# EAGLE design pebble (EAGLE 5.06)
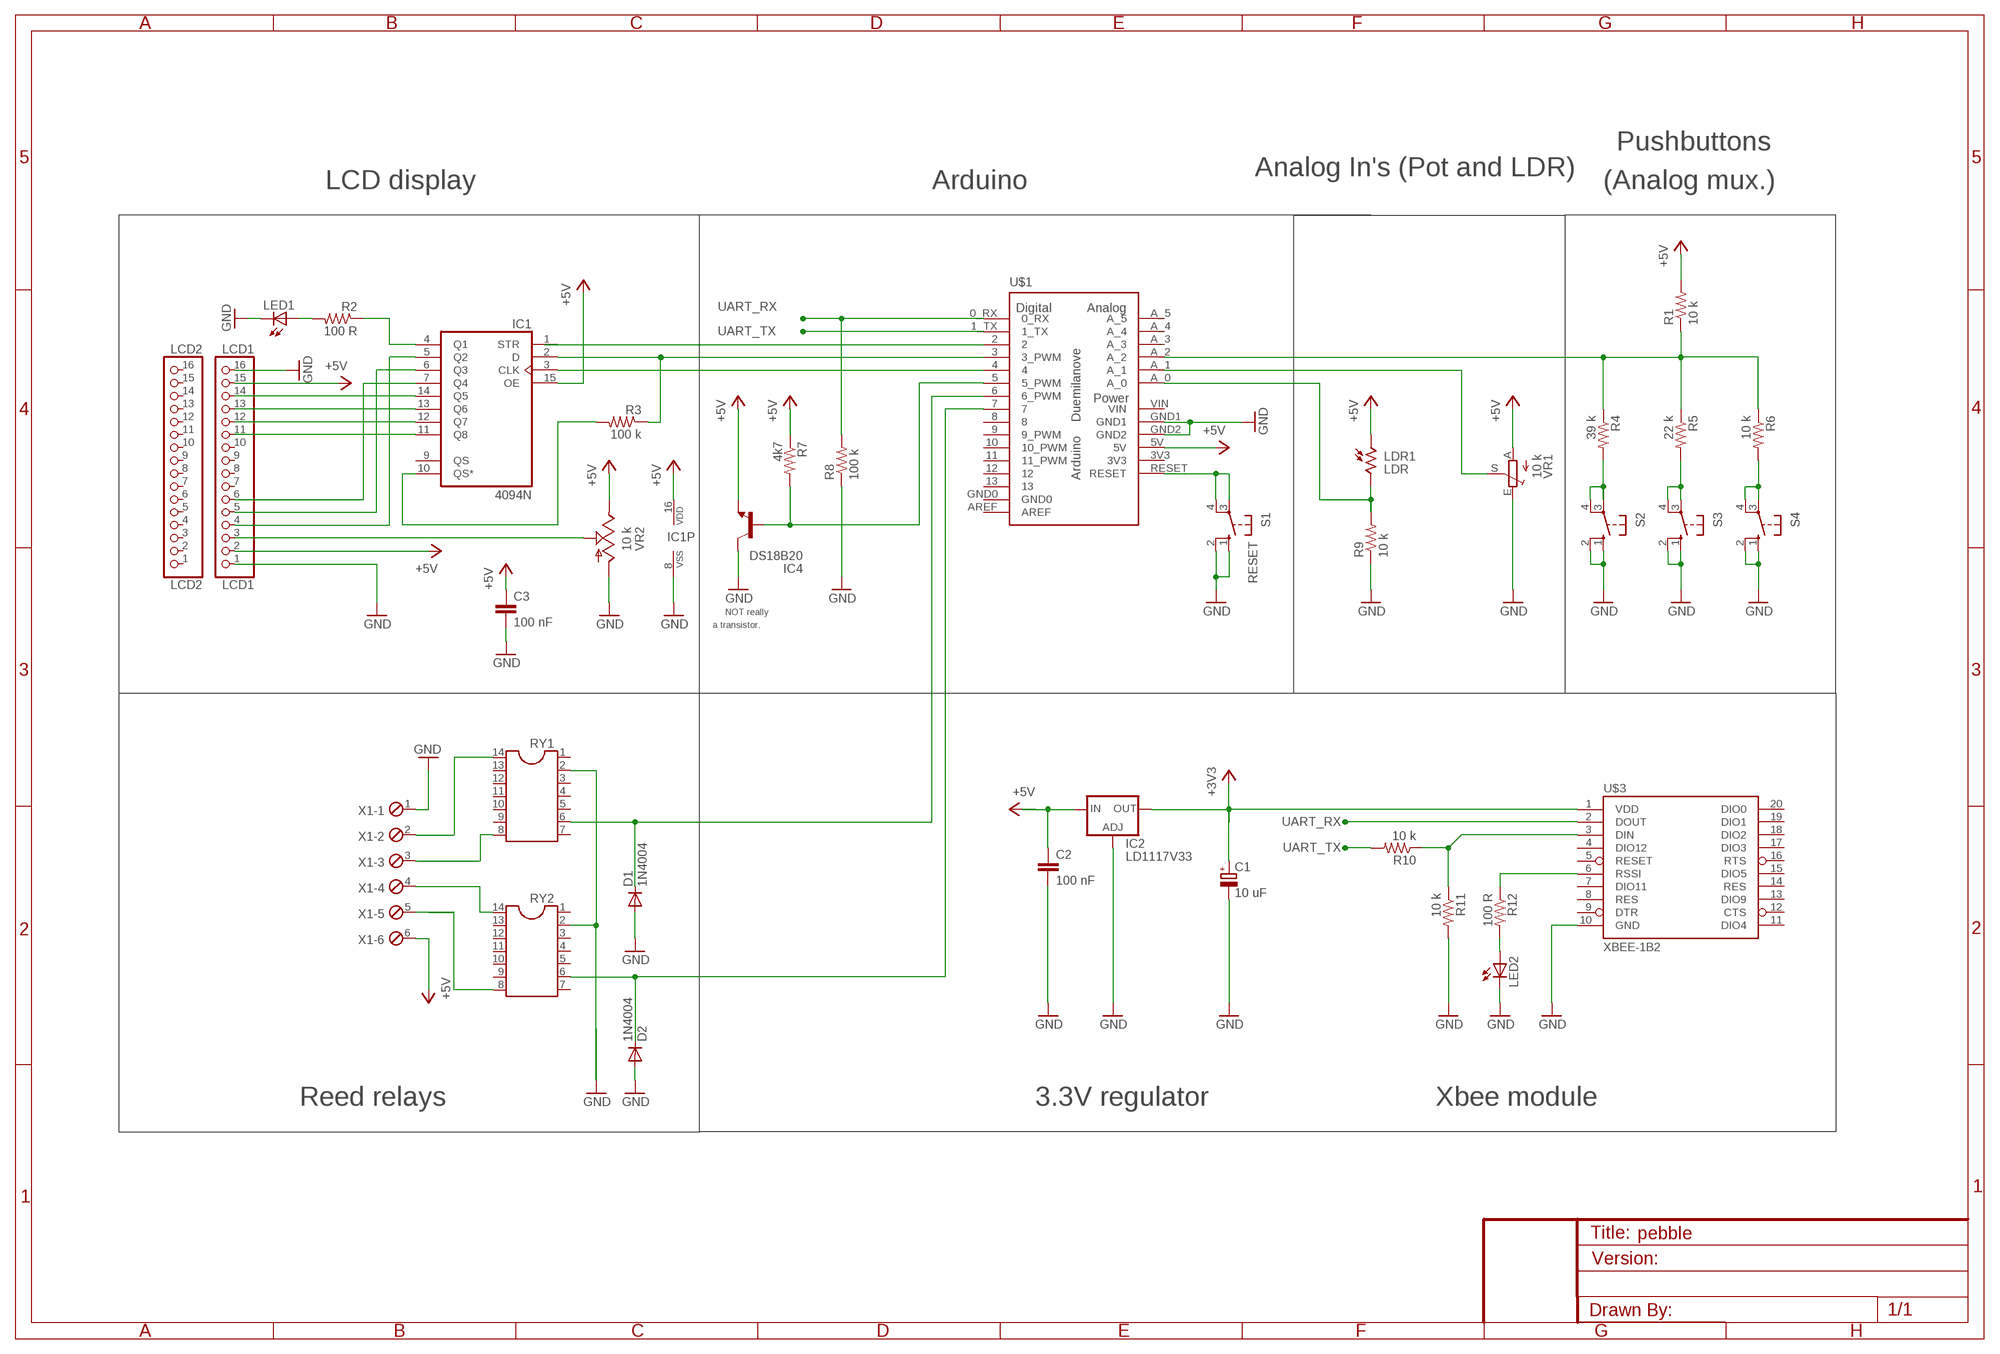
[diagram p0: schematic, sheet 1]

## Parts
C1  10 uF  CPOL-EUE2,5-6E  [E2,5-6E]
C2  100 nF  C2.5/2  [C2.5-2]
C3  100 nF  C2.5/2  [C2.5-2]
D1  1N4004  DIODEPTH  [DIODE-1N4001]
D2  1N4004  DIODEPTH  [DIODE-1N4001]
IC1  4094N  [DIL16]
IC2  LD1117V33  LD117AV33  [TO220L1]
IC4  DS18B20  BC548  [TO92-EBC]
LCD1  LCD1  PINHD-1X16  [1X16]
LCD2  LCD2  PINHD-1X16  [1X16]
LDR1  LDR  VT80N1  [VT800]
LED1  LED3MM  [LED3MM]
LED2  LED3MM  [LED3MM]
R1  10 k  RESISTORPTH1  [AXIAL-0.3]
R2  100 R  RESISTORPTH1  [AXIAL-0.3]
R3  100 k  RESISTORPTH1  [AXIAL-0.3]
R4  39 k  RESISTORPTH1  [AXIAL-0.3]
R5  22 k  RESISTORPTH1  [AXIAL-0.3]
R6  10 k  RESISTORPTH1  [AXIAL-0.3]
R7  4k7  RESISTORPTH1  [AXIAL-0.3]
R8  100 k  RESISTORPTH1  [AXIAL-0.3]
R9  10 k  RESISTORPTH1  [AXIAL-0.3]
R10  10 k  RESISTORPTH1  [AXIAL-0.3]
R11  10 k  RESISTORPTH1  [AXIAL-0.3]
R12  100 R  RESISTORPTH1  [AXIAL-0.3]
RY1  DIL14S  [SOCKET-14]
RY2  DIL14S  [SOCKET-14]
S1  RESET  10-XX  [B3F-10XX]
S2  10-XX  [B3F-10XX]
S3  10-XX  [B3F-10XX]
S4  10-XX  [B3F-10XX]
U$1  ARDUINO-USBLONG_PADS_TEXT  [SHIELD]
U$3  XBEE-1B2  [XBEE-SILK]
VR1  10 k  TRIM_EU-B25V  [B25V]
VR2  10 k  TRIM_US-RS3  [RS3]
X1  MPT6  [6POL254]

## Nets
+3V3: C1.+ IC2.2(OUT) U$3.1(VDD)
+5V: C2.1 C3.1 IC1.15(OE) IC1.16(VDD) IC2.3(IN) IC4.E LCD1.2 LCD1.15 LDR1.1 R1.P$2 R7.P$1 U$1.5V VR1.A VR2.E X1.6
GND: C1.- C2.2 C3.2 D1.A D2.A IC1.8(VSS) IC2.1(ADJ) IC4.C LCD1.1 LCD1.16 LED1.K(C) LED2.K(C) R8.P$1 R9.P$1 R11.P$2 RY1.2 RY2.2 S1.1(S) S1.2(S1) S2.1(S) S2.2(S1) S3.1(S) S3.2(S1) S4.1(S) S4.2(S1) U$1.GND1 U$1.GND2 U$3.10(GND) VR1.E VR2.A X1.1
N$1: IC1.1(STR) U$1.2
N$2: IC1.3(CLK) U$1.4
N$3: IC1.2(D) R3.P$1 U$1.3(3_PWM)
N$5: D2.C RY2.6 U$1.7
N$6: R1.P$1 R4.P$1 R5.P$1 R6.P$1 U$1.A_2
N$7: IC1.4(Q1) R2.P$1
N$9: LED1.A R2.P$2
N$10: IC1.10(QS*) R3.P$2
N$11: U$1.A_1 VR1.S
N$13: LDR1.2 R9.P$2 U$1.A_0
N$14: IC1.11(Q8) LCD1.11
N$15: IC1.12(Q7) LCD1.12
N$16: IC1.13(Q6) LCD1.13
N$17: IC1.14(Q5) LCD1.14
N$18: IC1.5(Q2) LCD1.4
N$19: IC1.6(Q3) LCD1.5
N$20: IC1.7(Q4) LCD1.6
N$21: RY1.14 X1.2
N$22: IC4.B R7.P$2 U$1.5(5_PWM)
N$23: R12.P$1 U$3.6(RSSI)
N$24: LED2.A R12.P$2
N$26: R10.P$1 R11.P$1 U$3.3(DIN)
N$34: RY1.8 X1.3
N$64: RY2.14 X1.4
N$65: RY2.8 X1.5
N$66: D1.C RY1.6 U$1.6(6_PWM)
N$70: R4.P$2 S2.3(P) S2.4(P1)
N$72: R5.P$2 S3.3(P) S3.4(P1)
N$73: R6.P$2 S4.3(P) S4.4(P1)
N$93: LCD1.3 VR2.S
N$147: S1.3(P) S1.4(P1) U$1.RESET
UART_RX: R8.P$2 U$1.0_RX U$3.2(DOUT)
UART_TX: R10.P$2 U$1.1_TX
Unconnected: IC1.9(QS) LCD1.7 LCD1.8 LCD1.9 LCD1.10 LCD2.1 LCD2.2 LCD2.3 LCD2.4 LCD2.5 LCD2.6 LCD2.7 LCD2.8 LCD2.9 LCD2.10 LCD2.11 LCD2.12 LCD2.13 LCD2.14 LCD2.15 LCD2.16 RY1.1 RY1.3 RY1.4 RY1.5 RY1.7 RY1.9 RY1.10 RY1.11 RY1.12 RY1.13 RY2.1 RY2.3 RY2.4 RY2.5 RY2.7 RY2.9 RY2.10 RY2.11 RY2.12 RY2.13 U$1.8 U$1.9(9_PWM) U$1.10(10_PWM) U$1.11(11_PWM) U$1.12 U$1.13 U$1.A_3 U$1.A_4 U$1.A_5 U$1.AREF U$1.GND0 U$3.4(DIO12) U$3.5(RESET) U$3.7(DIO11) U$3.8(RES) U$3.9(DTR) U$3.11(DIO4) U$3.12(CTS) U$3.13(DIO9) U$3.14(RES) U$3.15(DIO5) U$3.16(RTS) U$3.17(DIO3) U$3.18(DIO2) U$3.19(DIO1) U$3.20(DIO0)

## Notes on the sheet
- Pushbuttons
- Analog In's (Pot and LDR)
- LCD display | Arduino | (Analog mux.)
- NOT really
- a transistor.
- Reed relays | 3.3V regulator | Xbee module

## Power pins joined to a net without a drawn wire
3V3: U$1.3V3
VIN: U$1.VIN

## Library data of the parts
C1 = rcl:CPOL-EU: POLARIZED CAPACITOR, European symbol
C2 C3 = capacitor-wima:C: CAPACITOR naming: grid - package width
D1 D2 = SparkFun:DIODE: Diode These are standard reverse protection diodes and small signal diodes. SMA package can handle up to about 1A. SOD-323 can handle about 200mA. What the SOD-323 package when ordering, there are some mfgs out there that are 5-pin packages.
IC1 = 40xx:4094: 8-stage SHIFT/STORE REGISTER, tri-state
IC2 = v-reg:LD117A?*: Low drop fixed and adjustable positive voltage regulators 1 A Source: http://www.st.com/stonline/products/literature/ds/7194/ld1117axx.pdf
IC4 = transistor-npn:BC548*: NPN Transistor
LCD1 LCD2 = pinhead:PINHD-1X16: PIN HEADER
LDR1 = photo-elements:VT8: Photoconductive Cell VT800 Series Source: http://optoelectronics.perkinelmer.com/content/Datasheets/DTS_vt800seriesdatasheet.pdf
LED1 LED2 = led:LED: LED OSRAM: - CHIPLED LG R971, LG N971, LY N971, LG Q971, LY Q971, LO R971, LY R971 LH N974, LH R974 LS Q976, LO Q976, LY Q976 LO Q996 - Hyper CHIPLED LW Q18S LB Q993, LB Q99A, LB R99A - SideLED LS A670, LO A670, LY A670, LG A670, LP A670 LB A673, LV A673, LT A673, LW A673 LH A674 LY A675 LS A676, LA A676, LO A676, LY A676, LW A676 LS A679, LY A679, LG A679 - Hyper Micro SIDELED® LS Y876, LA Y876, LO Y876, LY Y876 LT Y87S - SmartLED LW L88C, LW L88S LB L89C, LB L89S, LG L890 LS L89K, LO L89K, LY L89K LS L896, LA L896, LO L896, LY L896 - TOPLED LS T670, LO T670, LY T670, LG T670, LP T670 LSG T670, LSP T670, LSY T670, LOP T670, LYG T670 LG T671, LOG T671, LSG T671 LB T673, LV T673, LT T673, LW T673 LH T674 LS T676, LA T676, LO T676, LY T676, LB T676, LH T676, LSB T676, LW T676 LB T67C, LV T67C, LT T67C, LS T67K, LO T67K, LY T67K, LW E67C LS E67B, LA E67B, LO E67B, LY E67B, LB E67C, LV E67C, LT E67C LW T67C LS T679, LY T679, LG T679 LS T770, LO T770, LY T770, LG T770, LP T770 LB T773, LV T773, LT T773, LW T773 LH T774 LS E675, LA E675, LY E675, LS T675 LS T776, LA T776, LO T776, LY T776, LB T776 LHGB T686 LT T68C, LB T68C - Hyper Mini TOPLED® LB M676 - Mini TOPLED Santana® LG M470 LS M47K, LO M47K, LY M47K Source: http://www.osram.convergy.de LUXEON: - LUMILED® LXK2-PW12-R00, LXK2-PW12-S00, LXK2-PW14-U00, LXK2-PW14-V00 LXK2-PM12-R00, LXK2-PM12-S00, LXK2-PM14-U00 LXK2-PE12-Q00, LXK2-PE12-R00, LXK2-PE12-S00, LXK2-PE14-T00, LXK2-PE14-U00 LXK2-PB12-K00, LXK2-PB12-L00, LXK2-PB12-M00, LXK2-PB14-N00, LXK2-PB14-P00, LXK2-PB14-Q00 LXK2-PR12-L00, LXK2-PR12-M00, LXK2-PR14-Q00, LXK2-PR14-R00 LXK2-PD12-Q00, LXK2-PD12-R00, LXK2-PD12-S00 LXK2-PH12-R00, LXK2-PH12-S00 LXK2-PL12-P00, LXK2-PL12-Q00, LXK2-PL12-R00 Source: www.luxeon.com KINGBRIGHT: KA-3528ASYC Source: www.kingbright.com
R1-R12 = SparkFun:RESISTOR: Resistor Basic schematic elements and footprints for 0603, 1206, and PTH 1/10th watt (small) resistors.
RY1 RY2 = ic-package:DIL14: Dual In Line / Socket
S1-S4 = switch-omron:10-XX: OMRON SWITCH
U$1 = Arduino-Various:ARDUINO-USB: The Ardiuno Duemilanove Pinouts layoutet as a Bare Shield. v0.5 Also for Arduino Diecimila. This is designed as a Part and has no Outline in the Dimension Layer. The Outline, when present, is drawed at the tPlace / bPlace Layer. Library by Stephanie Lange, http://www.k-ita.de/~sl/
U$3 = xbee:XBEE-1
VR1 = pot:TRIM_EU-: POTENTIOMETER
VR2 = pot:TRIM_US-: POTENTIOMETER
X1 = con-phoenix-254:MPT6: PHOENIX CONNECTOR

## Board
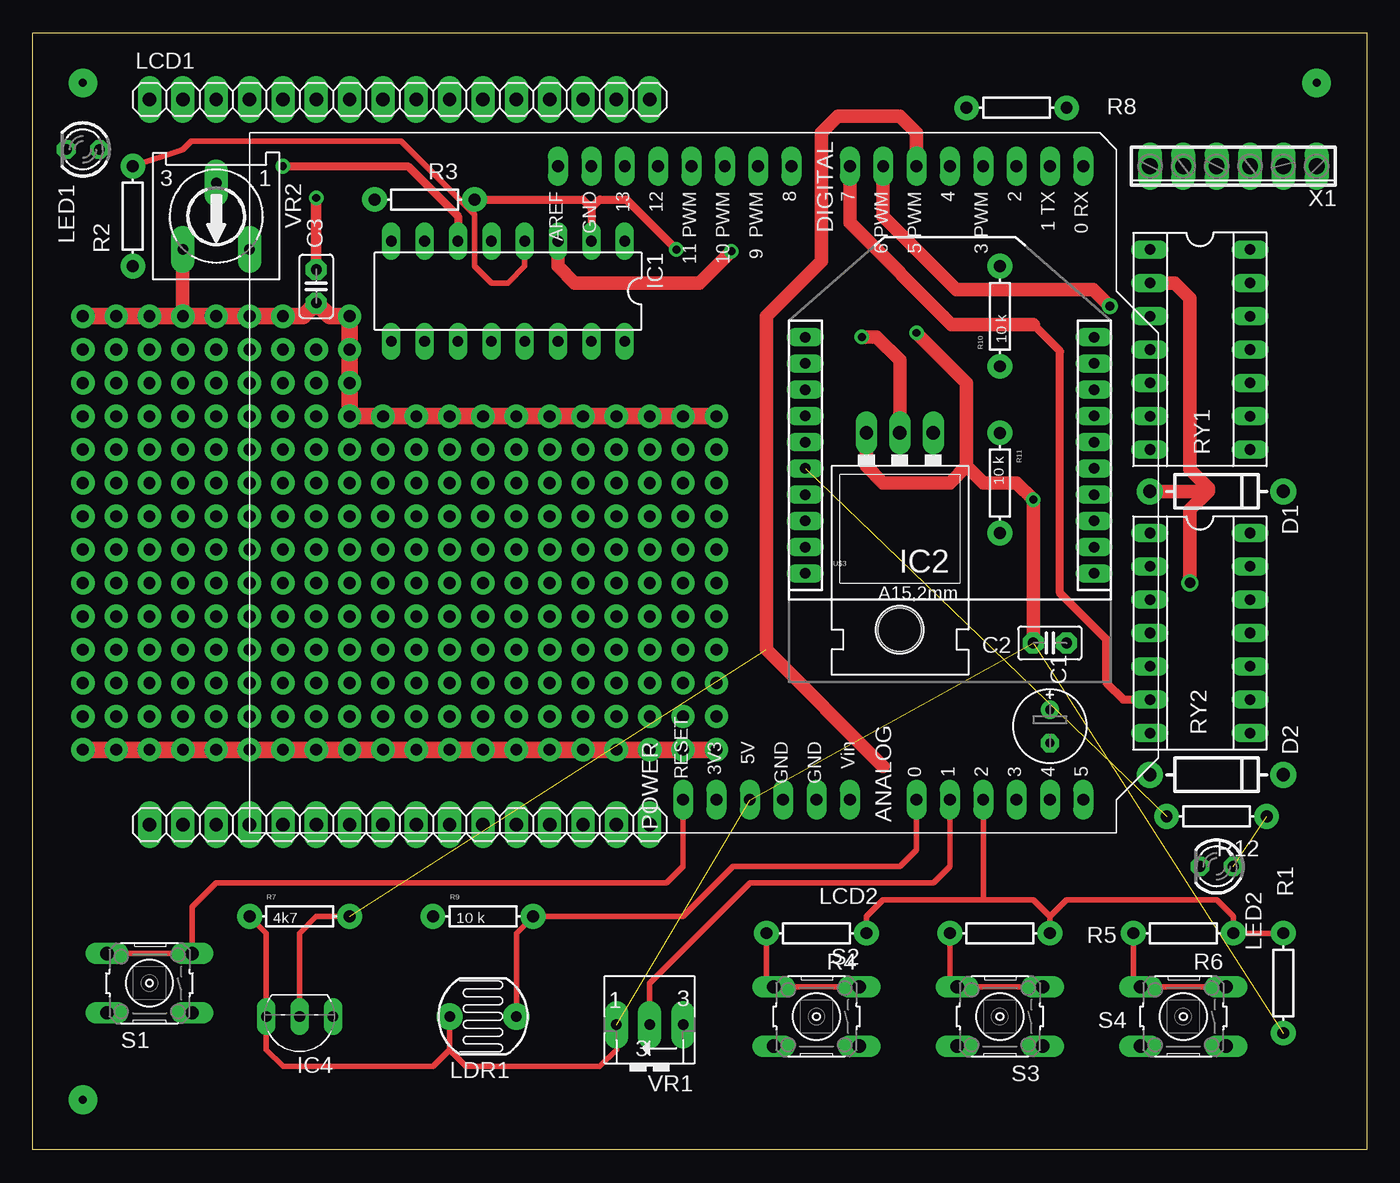
[diagram p1: board, top side]
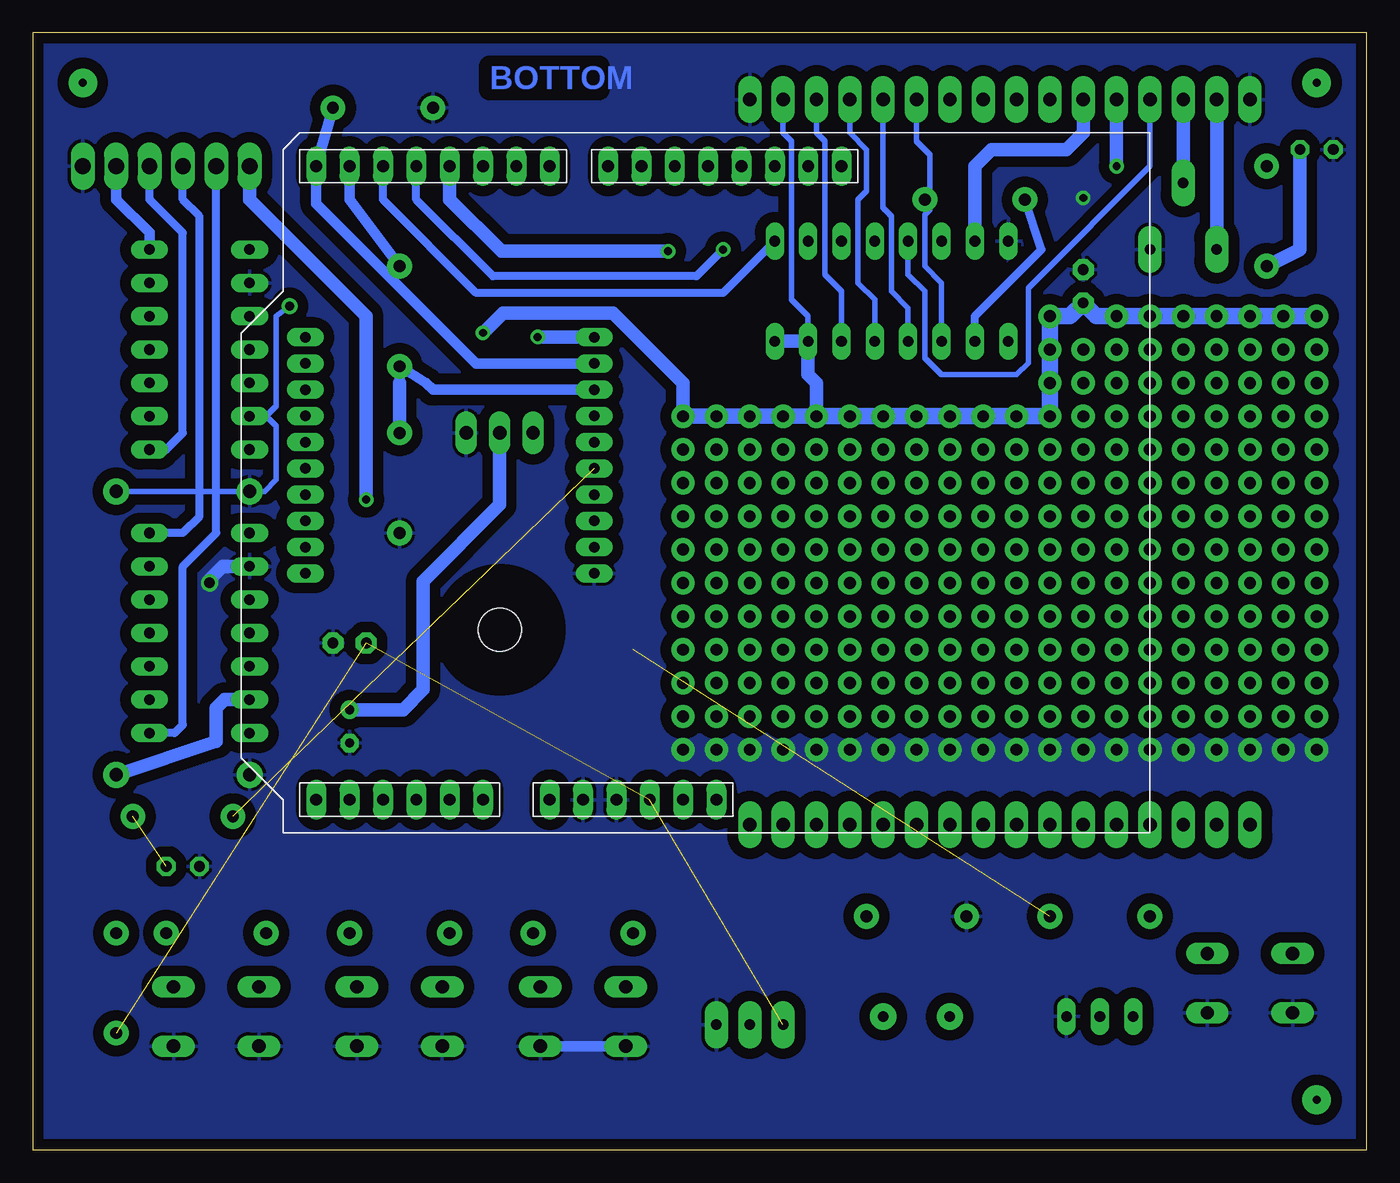
[diagram p2: board, bottom side, seen from below]

Size 101.6 x 85.09 mm. Coordinates in mm from the lower left corner, seen from the top.
Outline: 0,85.09 101.6,85.09 101.6,0 0,0 0,85.09
Copper layers (1*16): Top 0.035mm / dielectric 1.5mm / Bottom 0.035mm
Design rules "SparkFun": minimum track width 8mil, minimum drill 20mil, track to track 8mil, track to pad 8mil, pad to pad 8mil, via to via 8mil, smd to smd 8mil, copper to edge 10mil, drill to drill 8mil, minimum pad ring 12mil, minimum via ring 10mil, stop-mask expansion 4mil, vias tented up to drill 25mil, thermal gap 10mil

### Footprints (pad centres in the part's own frame; a part is rotated, then mirrored left to right if it is on the bottom)
E2,5-6E = drill 0.7 pad 1.4 round: + -1.27,0 | drill 0.7 pad 1.4 octagon: - 1.27,0
C2.5-2 = drill 0.813 pad 1.6 octagon: 1 -1.27,0; 2 1.27,0
DIODE-1N4001 = drill 1 pad 1.981 round: A -5.08,0; C 5.08,0
DIL16 = drill 0.813 long: 1 -8.89,-3.81; 2 -6.35,-3.81; 3 -3.81,-3.81; 4 -1.27,-3.81; 5 1.27,-3.81; 6 3.81,-3.81; 7 6.35,-3.81; 8 8.89,-3.81; 9 8.89,3.81; 10 6.35,3.81; 11 3.81,3.81; 12 1.27,3.81; 13 -1.27,3.81; 14 -3.81,3.81; 15 -6.35,3.81; 16 -8.89,3.81
TO220L1 = drill 1.016 long: 1 -2.54,-3.81; 2 0,-3.81; 3 2.54,-3.81 | hole 3.302: 0,11.176
TO92-EBC = drill 0.813 long: B 0,-1.27; C -2.54,-1.27; E 2.54,-1.27
1X16 = drill 1.016 pad 1.8 long: 1 -19.05,0; 2 -16.51,0; 3 -13.97,0; 4 -11.43,0; 5 -8.89,0; 6 -6.35,0; 7 -3.81,0; 8 -1.27,0; 9 1.27,0; 10 3.81,0; 11 6.35,0; 12 8.89,0; 13 11.43,0; 14 13.97,0; 15 16.51,0; 16 19.05,0
VT800 = drill 0.8 pad 2 round: 1 -2.54,0; 2 2.54,0
LED3MM = drill 0.813 octagon: A -1.27,0; K 1.27,0
AXIAL-0.3 = drill 0.9 pad 1.88 round: P$1 -3.81,0; P$2 3.81,0
SOCKET-14 = drill 0.813 long: 1 -7.62,-3.81; 2 -5.08,-3.81; 3 -2.54,-3.81; 4 0,-3.81; 5 2.54,-3.81; 6 5.08,-3.81; 7 7.62,-3.81; 8 7.62,3.81; 9 5.08,3.81; 10 2.54,3.81; 11 0,3.81; 12 -2.54,3.81; 13 -5.08,3.81; 14 -7.62,3.81
B3F-10XX = drill 1.016 long: 1 -3.251,2.261; 2 3.251,2.261; 3 -3.251,-2.261; 4 3.251,-2.261
SHIELD = drill 0.9 pad 1.27 long: 0_RX -25.4,27.94; 1_TX -25.4,25.4; 2 -25.4,22.86; 3 -25.4,20.32; 3V3 22.86,0; 4 -25.4,17.78; 5 -25.4,15.24; 5V 22.86,2.54; 6 -25.4,12.7; 7 -25.4,10.16; 8 -25.4,5.715; 9 -25.4,3.175; 10 -25.4,0.635; 11 -25.4,-1.905; 12 -25.4,-4.445; 13 -25.4,-6.985; A_0 22.86,15.24; A_1 22.86,17.78; A_2 22.86,20.32; A_3 22.86,22.86; A_4 22.86,25.4; A_5 22.86,27.94; AREF -25.4,-12.065; GND0 -25.4,-9.525; GND1 22.86,7.62; GND2 22.86,5.08; RESET 22.86,-2.54; VIN 22.86,10.16
XBEE-SILK = drill 0.8 long: 1 -11,20; 2 -11,18; 3 -11,16; 4 -11,14; 5 -11,12; 6 -11,10; 7 -11,8; 8 -11,6; 9 -11,4; 10 -11,2; 11 11,2; 12 11,4; 13 11,6; 14 11,8; 15 11,10; 16 11,12; 17 11,14; 18 11,16; 19 11,18; 20 11,20
B25V = drill 0.8 pad 1.8 long: A 2.54,0.635; E -2.54,0.635; S 0,0.635
RS3 = drill 0.8 pad 1.8 long: A -2.54,2.54; E 2.54,2.54; S 0,-2.54
6POL254 = drill 1.2 pad 1.778 long: 1 -6.35,0; 2 -3.81,0; 3 -1.27,0; 4 1.27,0; 5 3.81,0; 6 6.35,0

### Placement (x,y rotation side)
C1  77.47,32.26 270 top
C2  77.47,38.61 0 top
C3  21.59,65.79 90 top
D1  90.17,50.16 0 top
D2  90.17,28.58 0 top
IC1  36.2,65.41 180 top
IC2  66.04,50.8 180 top
IC4  20.32,8.89 180 top
LCD1  27.94,80.01 0 top
LCD2  27.94,24.77 0 top
LDR1  34.29,10.16 0 top
LED1  3.81,76.2 180 top
LED2  90.17,21.59 180 top
R1  95.25,12.7 270 top
R2  7.62,71.12 270 top
R3  29.84,72.39 180 top
R4  59.69,16.51 180 top
R5  73.66,16.51 180 top
R6  87.63,16.51 180 top
R7  20.32,17.78 0 top
R8  74.93,79.38 0 top
R9  34.29,17.78 0 top
R10  73.66,63.5 90 top
R11  73.66,50.8 270 top
R12  90.17,25.4 0 top
RY1  88.9,60.96 270 top
RY2  88.9,39.37 270 top
S1  8.89,12.7 180 top
S2  59.69,10.16 180 top
S3  73.66,10.16 180 top
S4  87.63,10.16 180 top
U$1  52.07,49.53 270 top
U$3  69.85,41.91 0 top
VR1  46.99,10.16 180 top
VR2  13.97,71.12 180 top
X1  91.44,74.93 180 top

### Tracks (layer width: path | path; a pad name or v marks a point on that pad's centre or on a via)
+3V3  (via drill 0.6)
  Top 1.016: v63.14,61.93 64.26,61.93 66.04,60.15 IC2.2
  Bottom 1.016: IC2.2 66.04,49.15 71.88,43.31 71.88,35.05 73.41,33.53 C1.+ | U$3.1 63.13,61.91 v63.14,61.93
+5V  (via drill 0.6, 0.9 pad 1.78)  (3 unrouted)
  Top 0.406: R7.P$1 17.78,16.51 IC4.E 17.78,7.62 19.05,6.35 30.48,6.35 31.75,7.62 | VR1.A 44.45,7.62 43.18,6.35 33.02,6.35 31.75,7.62 | 31.75,7.62 LDR1.1
  Top 1.016: v11.43,63.5 VR2.E | IC2.3 63.5,52.07 64.77,50.8 69.85,50.8 71.12,52.07 | v67.31,62.23 71.12,58.42 71.12,52.07 | 71.12,52.07 72.39,50.8 74.93,50.8 v76.2,49.53 C2.1
  Top 1.17: v24.13,63.5 v24.13,60.96 v24.13,58.42 v24.13,55.88
  Top 1.27: v3.81,63.5 v6.35,63.5 v8.89,63.5 v11.43,63.5 v13.97,63.5 v16.51,63.5 v19.05,63.5 20.57,63.5 C3.1 22.61,63.5 v24.13,63.5 v24.13,55.88 | v52.07,55.88 v49.53,55.88 | v46.99,55.88 v49.53,55.88 | v41.91,55.88 v46.99,55.88 | v41.91,55.88 v39.37,55.88 | v24.13,55.88 v26.67,55.88 | v31.75,55.88 v34.29,55.88 | v29.21,55.88 v31.75,55.88 | v26.67,55.88 v29.21,55.88 | v39.37,55.88 v36.83,55.88 | v36.83,55.88 v34.29,55.88 | v46.99,55.88 v49.53,55.88 | v52.07,55.88 v49.53,55.88 | v41.91,55.88 v52.07,55.88 | v41.91,55.88 v39.37,55.88 | v39.37,55.88 v36.83,55.88 | v36.83,55.88 v34.29,55.88 | v24.13,55.88 v26.67,55.88 | v29.21,55.88 v31.75,55.88 | v36.83,55.88 v34.29,55.88 | v31.75,55.88 v34.29,55.88
  Bottom 0.406: LCD1.15 44.45,77.47 44.45,77.46
  Bottom 0.408: 44.45,77.46 43.81,76.83 43.81,64.77 42.54,63.5 IC1.15
  Bottom 0.61: VR2.E | IC1.15 IC1.16
  Bottom 1.016: v67.31,62.23 65.79,63.75 57.4,63.75 52.07,58.42 v52.07,55.88 | VR2.E LCD1.2 | v76.2,49.53 76.2,63.5 85.09,72.39 X1.6 | IC1.16 IC1.15 42.54,59.05 41.91,58.42 v41.91,55.88
  Bottom 1.17: v52.07,55.88 v44.45,55.88 v41.91,55.88
  Bottom 1.27: v41.91,55.88 v24.13,55.88 v24.13,63.5 22.61,63.5 C3.1 20.57,63.5 v19.05,63.5 v16.51,63.5 v13.97,63.5 v11.43,63.5 v8.89,63.5 v6.35,63.5 v3.81,63.5
GND  (via drill 0.6, 0.8, 0.9 pad 1.78)
  Top 0.813: C3.2 v21.59,72.52
  Top 1.016: RY1.2 87,66.04 88.14,64.9 88.14,51.82 89.54,50.42 89.54,50.16 | 89.54,50.16 D1.A | 89.54,50.16 88.14,48.77 v88.14,43.18
  Top 1.27: v3.81,30.48 v52.07,30.48
  Bottom 0.5: RY1.2 84.45,66.04
  Bottom 0.813: S2.2 S2.1
  Bottom 1.016: RY2.2 87.12,44.45 88.14,43.43
  other vias: 6.35,30.48 8.89,30.48 11.43,30.48 13.97,30.48 16.51,30.48 19.05,30.48 21.59,30.48 24.13,30.48 26.67,30.48 29.21,30.48 31.75,30.48 34.29,30.48 36.83,30.48 39.37,30.48 41.91,30.48 44.45,30.48 46.99,30.48 49.53,30.48
  pour Bottom (isolate 0.813): 0,85.09 101.6,85.09 101.6,0 0,0
N$1
  Bottom 0.61: U$1.2 74.93,72.39 67.82,65.28 49.02,65.28 IC1.1
N$2  (via drill 0.6)
  Top 1.016: IC1.3 40,67.31 41.27,66.04 50.8,66.04 v53.21,68.45
  Bottom 1.016: U$1.4 69.85,72.39 65.91,68.45 v53.21,68.45
N$3  (via drill 0.6)
  Top 0.61: R3.P$1 41.91,72.39 42.54,71.75 | 42.54,71.75 IC1.2 | 42.54,71.75 43.18,72.39 45.21,72.39 v49.02,68.58
  Bottom 0.61: U$1.3 72.39,72.39 66.55,66.55 51.05,66.55 v49.02,68.58
N$5
  Top 0.61: 76.2,62.87 78.23,60.83 78.23,42.42 81.79,38.86 81.79,35.56 83.06,34.29 RY2.6
  Top 1.016: U$1.7 62.23,70.61 69.98,62.87 76.2,62.87
  Bottom 1.016: RY2.6 87,34.29 87.63,33.66 87.63,31.12 D2.C
N$6
  Top 0.406: R4.P$1 63.5,17.78 64.77,19.05 72.39,19.05 | 72.39,19.05 76.2,19.05 77.47,17.78 | 77.47,17.78 R5.P$1 | 77.47,17.78 78.74,19.05 90.17,19.05 91.44,17.78 R6.P$1 R1.P$1 | 72.39,19.05 U$1.A_2
N$7
  Top 0.406: IC1.4 37.46,67.31 36.2,66.04 34.92,66.04 33.65,67.31 33.65,71.25 28.07,76.83 12.07,76.83 11.43,76.2 R2.P$1
N$9
  Bottom 1.016: LED1.A 5.08,68.58 R2.P$2
N$10
  Bottom 0.61: R3.P$2 24.77,68.58 29.84,63.5 IC1.10
N$11
  Top 0.406: U$1.A_1 69.85,21.59 68.58,20.32 54.61,20.32 46.99,12.7 VR1.S
N$12  (via drill 0.6 pad 2.18)
  other vias: 143.51,7.62
N$13
  Top 0.406: LDR1.2 36.83,16.51 R9.P$2 49.53,17.78 53.34,21.59 66.04,21.59 67.31,22.86 U$1.A_0
N$14
  Bottom 0.406: LCD1.11 34.29,76.83 33.27,75.82 33.27,71.63 33.65,71.25 33.65,67.31 33.65,67.3
  Bottom 0.408: 33.65,67.3 32.38,66.04 IC1.11
N$15
  Bottom 0.406: 36.2,66.67 36.19,65.4 36.19,71.11 36.83,71.75 LCD1.12
  Bottom 0.408: 36.19,65.4 34.92,64.13 IC1.12
N$16
  Bottom 0.406: LCD1.13 39.37,77.47 39.36,77.46 | 38.1,73.66 38.1,73.02 38.73,72.39 38.73,70.48
  Bottom 0.408: 39.36,77.46 38.1,76.2 38.1,73.66 | 38.73,70.48 38.73,66.04 37.46,64.77 IC1.13
N$17
  Bottom 0.406: LCD1.14 41.91,77.47 41.9,77.46
  Bottom 0.408: 41.9,77.46 41.27,76.83 41.27,66.67 40,65.41 IC1.14
N$18
  Bottom 0.406: 29.84,59.05 26.67,59.05 25.78,59.94 25.78,65.66 25.4,66.04
  Bottom 0.408: IC1.5 34.92,66.67 33.65,65.41 33.65,60.33 32.38,59.05 29.84,59.05 | LCD1.4 16.51,74.93 25.4,66.04
  Bottom 0.61: LCD1.4
N$19  (via drill 0.6)
  Top 0.61: IC1.6 32.38,71.12 28.57,74.93 v19.05,74.93
  Bottom 0.61: LCD1.5
  Bottom 1.016: v19.05,74.93 LCD1.5
N$20
  Bottom 1.016: LCD1.6 21.59,77.47 22.86,76.2 28.57,76.2 29.84,74.93 IC1.7
N$21
  Bottom 0.813: RY1.14 92.71,69.85 95.25,72.39 X1.2
N$22  (1 unrouted)
  Top 0.406: IC4.B 20.32,16.51 21.59,17.78 R7.P$2
  Top 1.016: U$1.5 67.31,77.47 66.04,78.74 61.34,78.74 60.07,77.47 60.07,67.69 55.88,63.5 55.88,38.1 64.77,29.21
N$23  (1 unrouted)
N$24  (1 unrouted)
N$26
  Bottom 0.61: R11.P$1 73.66,55.88
  Bottom 0.813: 73.66,58.42 R10.P$1 71.63,58.42 71.12,57.91 U$3.3
  Bottom 1.016: 73.66,58.42 R11.P$1
N$30  (via drill 0.6 pad 2.18)
  other vias: 3.81,3.81
N$34
  Bottom 0.61: RY1.8 91.44,53.34 90.17,54.61 90.17,69.85 92.71,72.39 X1.3
N$39  (via drill 0.9 pad 1.78)
  other vias: 52.07,53.34
N$40  (via drill 0.9 pad 1.78)
  other vias: 52.07,50.8
N$41  (via drill 0.9 pad 1.78)
  other vias: 24.13,53.34
N$42  (via drill 0.9 pad 1.78)
  other vias: 24.13,50.8
N$43  (via drill 0.9 pad 1.78)
  other vias: 49.53,53.34
N$44  (via drill 0.9 pad 1.78)
  other vias: 46.99,53.34
N$45  (via drill 0.9 pad 1.78)
  other vias: 44.45,53.34
N$46  (via drill 0.9 pad 1.78)
  other vias: 41.91,53.34
N$47  (via drill 0.9 pad 1.78)
  other vias: 39.37,53.34
N$48  (via drill 0.9 pad 1.78)
  other vias: 26.67,53.34
N$49  (via drill 0.9 pad 1.78)
  other vias: 36.83,53.34
N$50  (via drill 0.9 pad 1.78)
  other vias: 26.67,50.8
N$51  (via drill 0.9 pad 1.78)
  other vias: 29.21,50.8
N$52  (via drill 0.9 pad 1.78)
  other vias: 29.21,53.34
N$53  (via drill 0.9 pad 1.78)
  other vias: 31.75,53.34
N$54  (via drill 0.9 pad 1.78)
  other vias: 31.75,50.8
N$55  (via drill 0.9 pad 1.78)
  other vias: 3.81,55.88
N$56  (via drill 0.9 pad 1.78)
  other vias: 34.29,50.8
N$57  (via drill 0.9 pad 1.78)
  other vias: 34.29,53.34
N$58  (via drill 0.9 pad 1.78)
  other vias: 36.83,50.8
N$59  (via drill 0.9 pad 1.78)
  other vias: 39.37,50.8
N$60  (via drill 0.9 pad 1.78)
  other vias: 41.91,50.8
N$61  (via drill 0.9 pad 1.78)
  other vias: 44.45,50.8
N$62  (via drill 0.9 pad 1.78)
  other vias: 46.99,50.8
N$63  (via drill 0.9 pad 1.78)
  other vias: 49.53,50.8
N$64
  Bottom 0.61: RY2.14 90.17,46.99 88.9,48.26 88.9,71.12 90.17,72.39 X1.4
N$65
  Bottom 0.61: RY2.8 90.81,31.75 90.17,32.38 90.17,44.45 87.63,46.99 X1.5
N$66  (via drill 0.7)
  Top 1.016: U$1.6 64.77,71.12 70.36,65.53 80.77,65.53 v82.04,64.26
  Bottom 0.406: v82.04,64.26 83.06,63.5 83.06,56.64 83.82,55.88 | 83.82,55.88 RY1.6 | 83.82,55.88 83.06,55.12 83.06,51.05 83.95,50.16 D1.C
N$67  (via drill 0.6 pad 2.18)
  other vias: 3.81,81.28
N$68  (via drill 0.6 pad 2.18)
  other vias: 97.79,81.28
N$69  (via drill 0.9 pad 1.78)
  other vias: 3.81,58.42
N$70
  Top 0.406: S2.3 S2.4 55.88,12.98 R4.P$2
N$71  (via drill 0.9 pad 1.78)
  other vias: 3.81,60.96
N$72
  Top 0.406: S3.3 S3.4 69.85,12.98 R5.P$2
N$73
  Top 0.406: S4.3 S4.4 83.82,12.98 R6.P$2
N$82  (via drill 0.9 pad 1.78)
  other vias: 24.13,48.26
N$83  (via drill 0.9 pad 1.78)
  other vias: 26.67,48.26
N$84  (via drill 0.9 pad 1.78)
  other vias: 29.21,48.26
N$87  (via drill 0.9 pad 1.78)
  other vias: 31.75,48.26
N$88  (via drill 0.9 pad 1.78)
  other vias: 21.59,60.96
N$90  (via drill 0.9 pad 1.78)
  other vias: 3.81,53.34
N$91  (via drill 0.9 pad 1.78)
  other vias: 3.81,50.8
N$92  (via drill 0.9 pad 1.78)
  other vias: 21.59,58.42
N$93
  Bottom 0.61: VR2.S | LCD1.3
  Bottom 1.016: VR2.S LCD1.3
N$94  (via drill 0.9 pad 1.78)
  other vias: 21.59,55.88
N$95  (via drill 0.9 pad 1.78)
  other vias: 21.59,53.34
N$96  (via drill 0.9 pad 1.78)
  other vias: 21.59,50.8
N$97  (via drill 0.9 pad 1.78)
  other vias: 21.59,48.26
N$98  (via drill 0.9 pad 1.78)
  other vias: 34.29,45.72
N$100  (via drill 0.9 pad 1.78)
  other vias: 34.29,48.26
N$101  (via drill 0.9 pad 1.78)
  other vias: 31.75,45.72
N$102  (via drill 0.9 pad 1.78)
  other vias: 29.21,45.72
N$103  (via drill 0.9 pad 1.78)
  other vias: 29.21,43.18
N$104  (via drill 0.9 pad 1.78)
  other vias: 31.75,43.18
N$105  (via drill 0.9 pad 1.78)
  other vias: 34.29,43.18
N$106  (via drill 0.9 pad 1.78)
  other vias: 26.67,43.18
N$107  (via drill 0.9 pad 1.78)
  other vias: 26.67,45.72
N$108  (via drill 0.9 pad 1.78)
  other vias: 24.13,45.72
N$109  (via drill 0.9 pad 1.78)
  other vias: 21.59,45.72
N$110  (via drill 0.9 pad 1.78)
  other vias: 21.59,43.18
N$111  (via drill 0.9 pad 1.78)
  other vias: 24.13,43.18
N$112  (via drill 0.9 pad 1.78)
  other vias: 21.59,40.64
N$113  (via drill 0.9 pad 1.78)
  other vias: 24.13,40.64
N$114  (via drill 0.9 pad 1.78)
  other vias: 26.67,40.64
N$115  (via drill 0.9 pad 1.78)
  other vias: 29.21,40.64
N$116  (via drill 0.9 pad 1.78)
  other vias: 31.75,40.64
N$117  (via drill 0.9 pad 1.78)
  other vias: 34.29,40.64
N$121  (via drill 0.9 pad 1.78)
  other vias: 19.05,60.96
N$122  (via drill 0.9 pad 1.78)
  other vias: 19.05,58.42
N$123  (via drill 0.9 pad 1.78)
  other vias: 19.05,55.88
N$125  (via drill 0.9 pad 1.78)
  other vias: 6.35,60.96
N$126  (via drill 0.9 pad 1.78)
  other vias: 6.35,58.42
N$128  (via drill 0.9 pad 1.78)
  other vias: 6.35,55.88
N$129  (via drill 0.9 pad 1.78)
  other vias: 8.89,58.42
N$130  (via drill 0.9 pad 1.78)
  other vias: 8.89,60.96
N$131  (via drill 0.9 pad 1.78)
  other vias: 8.89,55.88
N$132  (via drill 0.9 pad 1.78)
  other vias: 11.43,55.88
N$133  (via drill 0.9 pad 1.78)
  other vias: 11.43,58.42
N$134  (via drill 0.9 pad 1.78)
  other vias: 11.43,60.96
N$135  (via drill 0.9 pad 1.78)
  other vias: 19.05,53.34
N$136  (via drill 0.9 pad 1.78)
  other vias: 16.51,55.88
N$137  (via drill 0.9 pad 1.78)
  other vias: 13.97,55.88
N$138  (via drill 0.9 pad 1.78)
  other vias: 13.97,58.42
N$139  (via drill 0.9 pad 1.78)
  other vias: 16.51,58.42
N$140  (via drill 0.9 pad 1.78)
  other vias: 16.51,60.96
N$141  (via drill 0.9 pad 1.78)
  other vias: 13.97,60.96
N$142  (via drill 0.9 pad 1.78)
  other vias: 16.51,53.34
N$143  (via drill 0.9 pad 1.78)
  other vias: 13.97,53.34
N$144  (via drill 0.9 pad 1.78)
  other vias: 11.43,53.34
N$145  (via drill 0.9 pad 1.78)
  other vias: 8.89,53.34
N$146  (via drill 0.9 pad 1.78)
  other vias: 6.35,53.34
N$147
  Top 0.406: U$1.RESET 49.53,21.59 48.26,20.32 13.97,20.32 12.14,18.49 S1.3 S1.4
N$149  (via drill 0.9 pad 1.78)
  other vias: 39.37,40.64
N$150  (via drill 0.9 pad 1.78)
  other vias: 36.83,40.64
N$152  (via drill 0.9 pad 1.78)
  other vias: 36.83,45.72
N$153  (via drill 0.9 pad 1.78)
  other vias: 36.83,43.18
N$154  (via drill 0.9 pad 1.78)
  other vias: 39.37,43.18
N$155  (via drill 0.9 pad 1.78)
  other vias: 39.37,45.72
N$161  (via drill 0.9 pad 1.78)
  other vias: 41.91,38.1
N$162  (via drill 0.9 pad 1.78)
  other vias: 39.37,38.1
N$163  (via drill 0.9 pad 1.78)
  other vias: 39.37,35.56
N$164  (via drill 0.9 pad 1.78)
  other vias: 41.91,35.56
N$167  (via drill 0.9 pad 1.78)
  other vias: 44.45,33.02
N$173  (via drill 0.9 pad 1.78)
  other vias: 39.37,33.02
N$174  (via drill 0.9 pad 1.78)
  other vias: 41.91,33.02
N$176  (via drill 0.9 pad 1.78)
  other vias: 36.83,38.1
N$177  (via drill 0.9 pad 1.78)
  other vias: 36.83,35.56
N$178  (via drill 0.9 pad 1.78)
  other vias: 34.29,38.1
N$179  (via drill 0.9 pad 1.78)
  other vias: 34.29,35.56
N$180  (via drill 0.9 pad 1.78)
  other vias: 34.29,33.02
N$181  (via drill 0.9 pad 1.78)
  other vias: 36.83,33.02
N$186  (via drill 0.9 pad 1.78)
  other vias: 31.75,38.1
N$187  (via drill 0.9 pad 1.78)
  other vias: 29.21,38.1
N$188  (via drill 0.9 pad 1.78)
  other vias: 29.21,35.56
N$189  (via drill 0.9 pad 1.78)
  other vias: 31.75,35.56
N$190  (via drill 0.9 pad 1.78)
  other vias: 19.05,50.8
N$191  (via drill 0.9 pad 1.78)
  other vias: 19.05,48.26
N$192  (via drill 0.9 pad 1.78)
  other vias: 19.05,45.72
N$193  (via drill 0.9 pad 1.78)
  other vias: 19.05,43.18
N$194  (via drill 0.9 pad 1.78)
  other vias: 19.05,40.64
N$195  (via drill 0.9 pad 1.78)
  other vias: 3.81,48.26
N$196  (via drill 0.9 pad 1.78)
  other vias: 6.35,50.8
N$197  (via drill 0.9 pad 1.78)
  other vias: 3.81,45.72
N$198  (via drill 0.9 pad 1.78)
  other vias: 3.81,43.18
N$199  (via drill 0.9 pad 1.78)
  other vias: 3.81,40.64
N$200  (via drill 0.9 pad 1.78)
  other vias: 3.81,38.1
N$201  (via drill 0.9 pad 1.78)
  other vias: 3.81,35.56
N$207  (via drill 0.9 pad 1.78)
  other vias: 3.81,33.02
N$210  (via drill 0.9 pad 1.78)
  other vias: 6.35,33.02
N$211  (via drill 0.9 pad 1.78)
  other vias: 6.35,35.56
N$212  (via drill 0.9 pad 1.78)
  other vias: 8.89,35.56
N$213  (via drill 0.9 pad 1.78)
  other vias: 8.89,33.02
N$218  (via drill 0.9 pad 1.78)
  other vias: 11.43,33.02
N$219  (via drill 0.9 pad 1.78)
  other vias: 11.43,35.56
N$235  (via drill 0.9 pad 1.78)
  other vias: 29.21,33.02
N$236  (via drill 0.9 pad 1.78)
  other vias: 31.75,33.02
N$238  (via drill 0.9 pad 1.78)
  other vias: 26.67,33.02
N$239  (via drill 0.9 pad 1.78)
  other vias: 24.13,33.02
N$240  (via drill 0.9 pad 1.78)
  other vias: 24.13,35.56
N$241  (via drill 0.9 pad 1.78)
  other vias: 26.67,35.56
N$242  (via drill 0.9 pad 1.78)
  other vias: 26.67,38.1
N$243  (via drill 0.9 pad 1.78)
  other vias: 24.13,38.1
N$244  (via drill 0.9 pad 1.78)
  other vias: 13.97,35.56
N$245  (via drill 0.9 pad 1.78)
  other vias: 13.97,33.02
N$246  (via drill 0.9 pad 1.78)
  other vias: 16.51,33.02
N$247  (via drill 0.9 pad 1.78)
  other vias: 16.51,35.56
N$248  (via drill 0.9 pad 1.78)
  other vias: 19.05,35.56
N$249  (via drill 0.9 pad 1.78)
  other vias: 19.05,33.02
N$250  (via drill 0.9 pad 1.78)
  other vias: 21.59,33.02
N$251  (via drill 0.9 pad 1.78)
  other vias: 21.59,35.56
N$252  (via drill 0.9 pad 1.78)
  other vias: 21.59,38.1
N$253  (via drill 0.9 pad 1.78)
  other vias: 19.05,38.1
N$254  (via drill 0.9 pad 1.78)
  other vias: 16.51,38.1
N$255  (via drill 0.9 pad 1.78)
  other vias: 16.51,40.64
N$256  (via drill 0.9 pad 1.78)
  other vias: 13.97,38.1
N$257  (via drill 0.9 pad 1.78)
  other vias: 13.97,40.64
N$258  (via drill 0.9 pad 1.78)
  other vias: 16.51,50.8
N$259  (via drill 0.9 pad 1.78)
  other vias: 16.51,48.26
N$260  (via drill 0.9 pad 1.68)
  other vias: 16.51,45.72
N$261  (via drill 0.9 pad 1.78)
  other vias: 16.51,43.18
N$262  (via drill 0.9 pad 1.78)
  other vias: 13.97,43.18
N$263  (via drill 0.9 pad 1.68)
  other vias: 13.97,45.72
N$264  (via drill 0.9 pad 1.78)
  other vias: 13.97,48.26
N$265  (via drill 0.9 pad 1.78)
  other vias: 13.97,50.8
N$266  (via drill 0.9 pad 1.78)
  other vias: 11.43,50.8
N$267  (via drill 0.9 pad 1.78)
  other vias: 11.43,48.26
N$268  (via drill 0.9 pad 1.78)
  other vias: 11.43,45.72
N$269  (via drill 0.9 pad 1.78)
  other vias: 11.43,43.18
N$270  (via drill 0.9 pad 1.78)
  other vias: 8.89,50.8
N$271  (via drill 0.9 pad 1.78)
  other vias: 8.89,48.26
N$272  (via drill 0.9 pad 1.78)
  other vias: 6.35,48.26
N$273  (via drill 0.9 pad 1.78)
  other vias: 11.43,38.1
N$274  (via drill 0.9 pad 1.78)
  other vias: 8.89,38.1
N$275  (via drill 0.9 pad 1.78)
  other vias: 6.35,38.1
N$276  (via drill 0.9 pad 1.78)
  other vias: 6.35,40.64
N$277  (via drill 0.9 pad 1.78)
  other vias: 8.89,40.64
N$278  (via drill 0.9 pad 1.78)
  other vias: 11.43,40.64
N$279  (via drill 0.9 pad 1.78)
  other vias: 8.89,43.18
N$280  (via drill 0.9 pad 1.78)
  other vias: 6.35,43.18
N$281  (via drill 0.9 pad 1.78)
  other vias: 6.35,45.72
N$282  (via drill 0.9 pad 1.78)
  other vias: 8.89,45.72
N$286  (via drill 0.9 pad 1.78)
  other vias: 39.37,48.26
N$287  (via drill 0.9 pad 1.78)
  other vias: 36.83,48.26
N$288  (via drill 0.9 pad 1.78)
  other vias: 41.91,48.26
N$299  (via drill 0.9 pad 1.78)
  other vias: 46.99,33.02
N$301  (via drill 0.9 pad 1.78)
  other vias: 49.53,33.02
N$303  (via drill 0.9 pad 1.78)
  other vias: 52.07,33.02
N$304  (via drill 0.9 pad 1.78)
  other vias: 52.07,35.56
N$305  (via drill 0.9 pad 1.78)
  other vias: 49.53,35.56
N$306  (via drill 0.9 pad 1.78)
  other vias: 52.07,38.1
N$307  (via drill 0.9 pad 1.78)
  other vias: 49.53,38.1
N$308  (via drill 0.9 pad 1.78)
  other vias: 41.91,45.72
N$309  (via drill 0.9 pad 1.78)
  other vias: 41.91,43.18
N$310  (via drill 0.9 pad 1.78)
  other vias: 41.91,40.64
N$311  (via drill 0.9 pad 1.78)
  other vias: 52.07,48.26
N$312  (via drill 0.9 pad 1.78)
  other vias: 49.53,48.26
N$313  (via drill 0.9 pad 1.78)
  other vias: 49.53,45.72
N$314  (via drill 0.9 pad 1.78)
  other vias: 52.07,45.72
N$315  (via drill 0.9 pad 1.78)
  other vias: 49.53,43.18
N$316  (via drill 0.9 pad 1.78)
  other vias: 49.53,40.64
N$317  (via drill 0.9 pad 1.78)
  other vias: 52.07,40.64
N$318  (via drill 0.9 pad 1.78)
  other vias: 52.07,43.18
N$319  (via drill 0.9 pad 1.78)
  other vias: 46.99,35.56
N$320  (via drill 0.9 pad 1.78)
  other vias: 44.45,35.56
N$321  (via drill 0.9 pad 1.78)
  other vias: 44.45,38.1
N$322  (via drill 0.9 pad 1.78)
  other vias: 46.99,45.72
N$323  (via drill 0.9 pad 1.78)
  other vias: 44.45,45.72
N$324  (via drill 0.9 pad 1.78)
  other vias: 44.45,48.26
N$325  (via drill 0.9 pad 1.78)
  other vias: 46.99,48.26
N$326  (via drill 0.9 pad 1.78)
  other vias: 46.99,43.18
N$327  (via drill 0.9 pad 1.78)
  other vias: 46.99,40.64
N$328  (via drill 0.9 pad 1.78)
  other vias: 46.99,38.1
N$329  (via drill 0.9 pad 1.78)
  other vias: 44.45,40.64
N$330  (via drill 0.9 pad 1.78)
  other vias: 44.45,43.18
UART_RX
  Bottom 0.813: R8.P$2 U$1.0_RX 80.01,72.07 67.85,59.91 U$3.2
UART_TX
  Bottom 0.813: U$1.1_TX 77.47,72.39 R10.P$2

### Text on the board
Bottom: BOTTOM
tDocu: Connected Community Hackerspace (Melbourne) | +5V | +5V | +5V | +5V | +5V | GND | GND | GND | GND | GND | GND | Pebble 1.2 - Luke Weston 2009